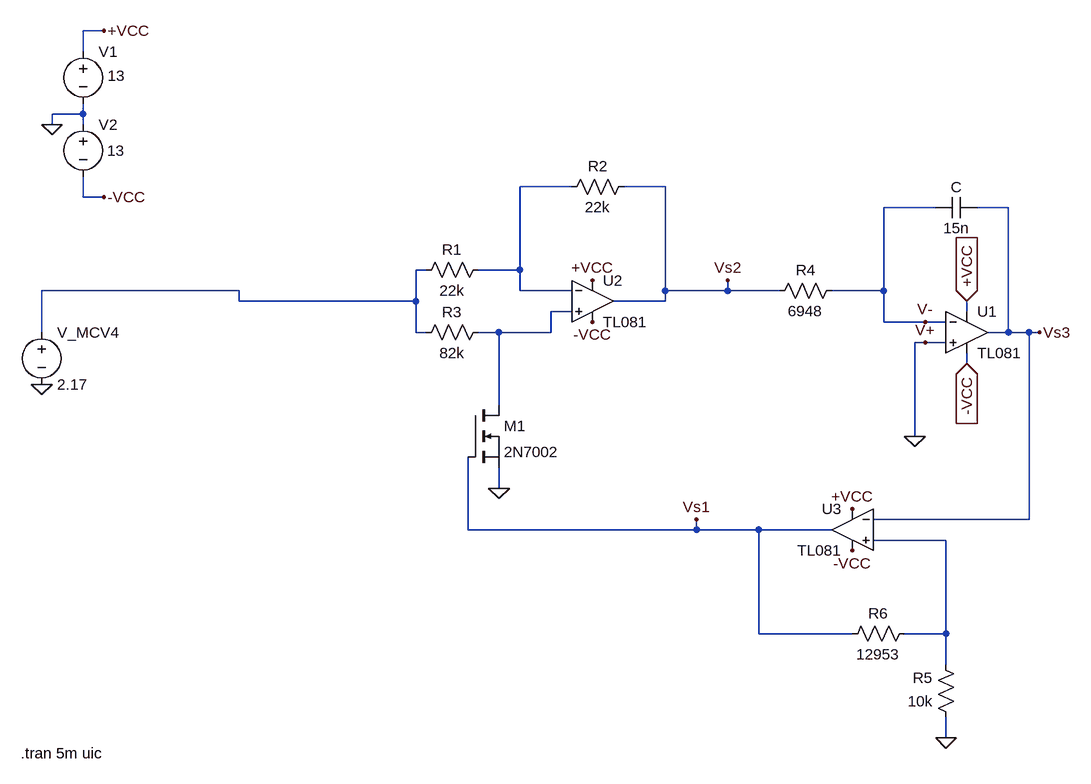
[diagram p0: schematic Ensemble_VCO.asc]
* Ensemble_VCO.asc
V1 +VCC 0 13
V2 0 -VCC 13
* U1: TL081 (symbol TL081 not available, pins judged from their places): In+=0 In-=V- V+=+VCC V-=-VCC OUT=Vs3
R4 V- Vs2 6948
C Vs3 V- 15n
* U2: TL081 (symbol TL081 not available, pins judged from their places): In+=N003 In-=N001 V+=+VCC V-=-VCC OUT=Vs2
* U3: TL081 (symbol TL081 not available, pins judged from their places): In+=N004 In-=Vs3 V+=+VCC V-=-VCC OUT=Vs1
R1 N001 N002 22k
R2 Vs2 N001 22k
R3 N003 N002 82k
R5 0 N004 10k
R6 N004 Vs1 12953
V_MCV4 N002 0 2.17
M1 N003 Vs1 0 0 2N7002
.model NMOS NMOS
.model PMOS PMOS
.lib standard.mos
.tran 5m uic
.backanno
.end

* Results of the author's LTspice run, read from the files saved beside the schematic
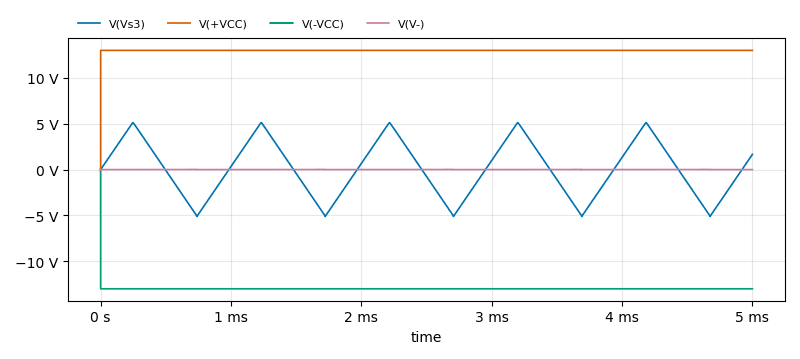
[diagram p1: Transient Analysis of Ensemble_VCO.asc, plotted from the saved traces]
* Transient Analysis, 1 run:
*   V(Vs3): min -5.118 V, max 5.117 V, average 57.31 mV, rms 4.032 V, last 1.661 V
*   V(+VCC): min 0 V, max 13 V, average 13 V, rms 13 V, last 13 V
*   V(-VCC): min -13 V, max 0 V, average -13 V, rms 13 V, last -13 V
*   V(V-): min -12.8 mV, max 13.9 mV, average -5.16 µV, rms 1.081 mV, last -957.7 µV